# EAGLE schematic lab3 (EAGLE 9.5.2)
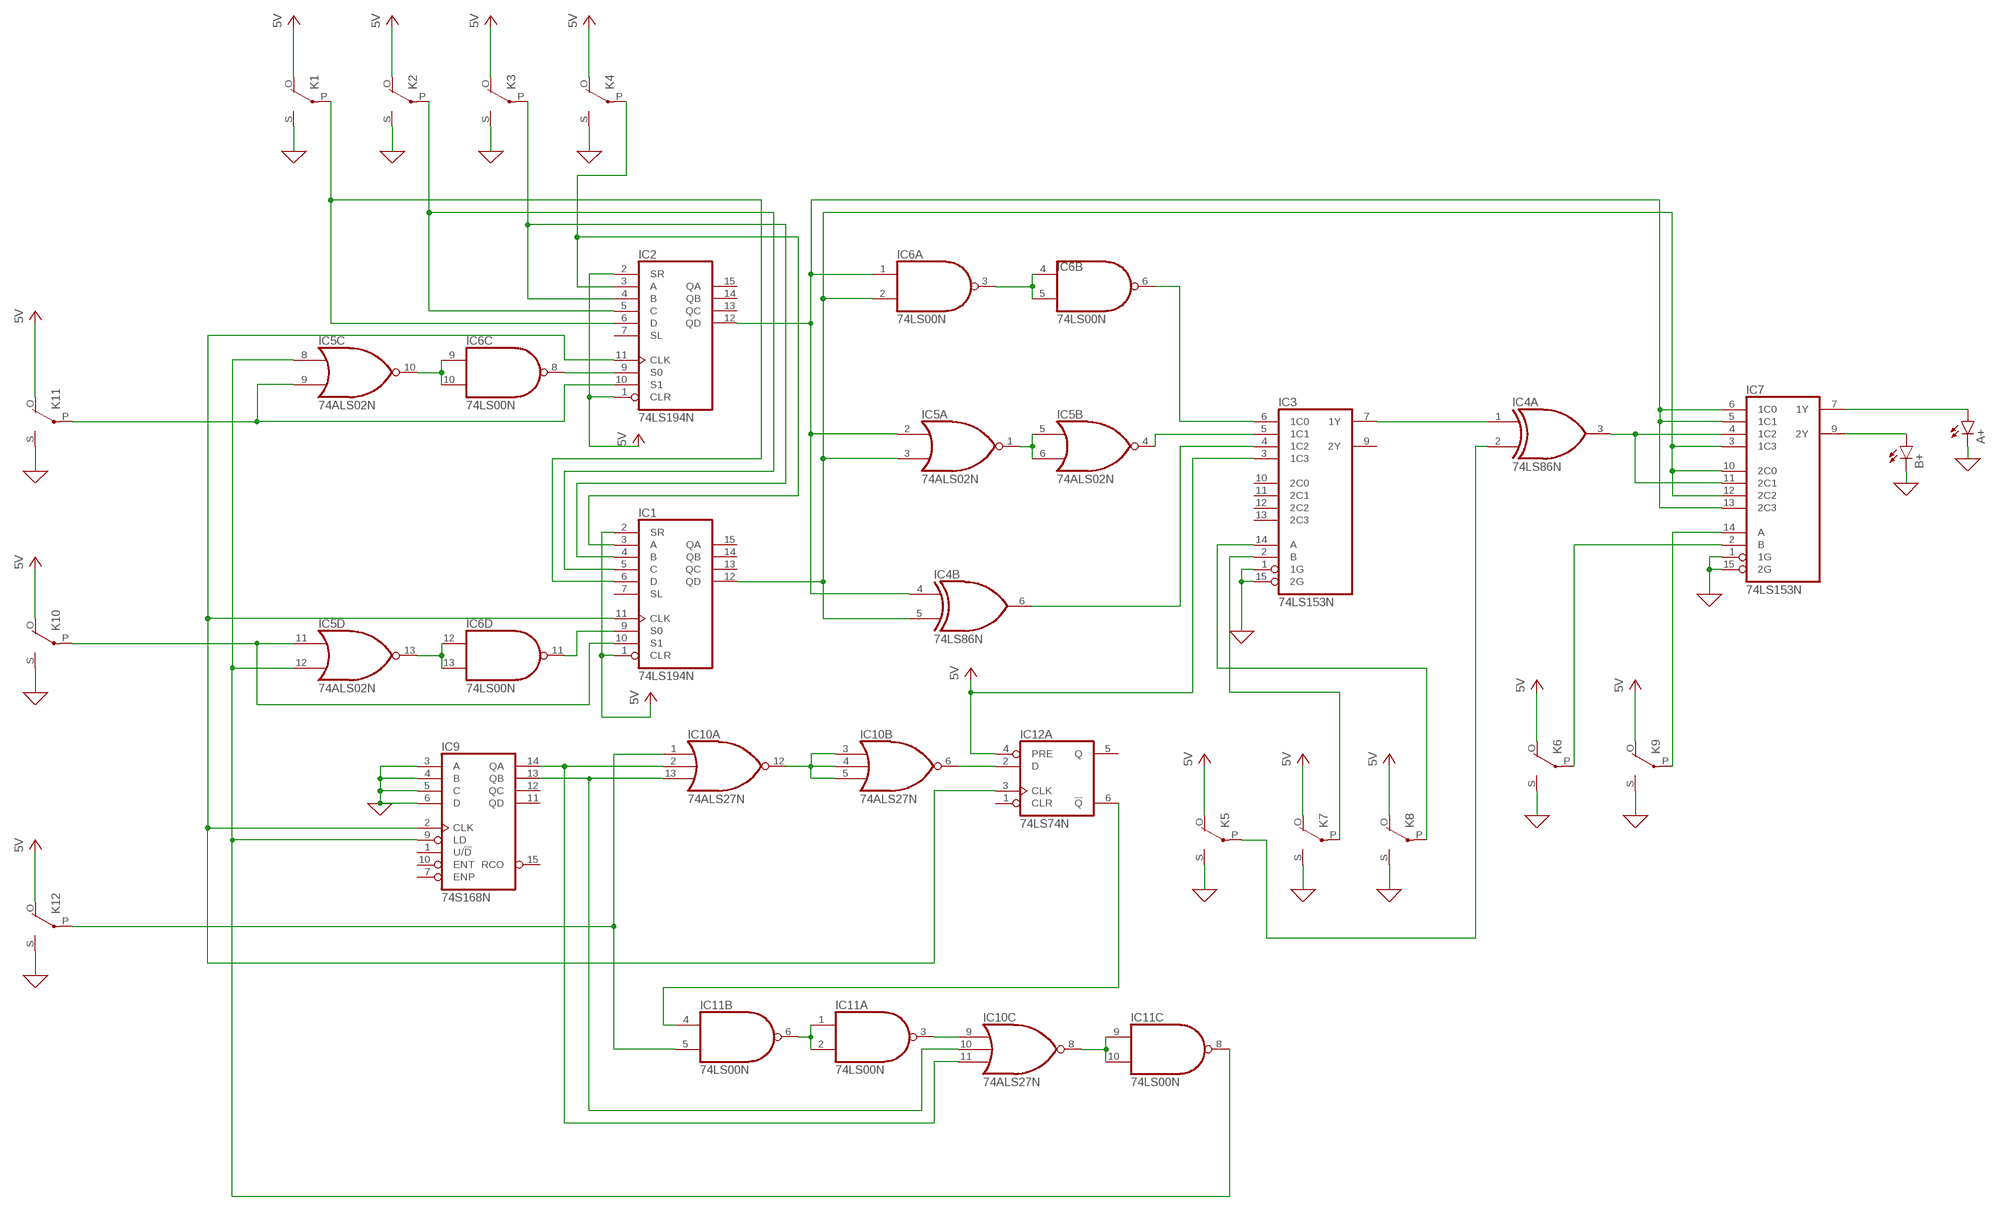
[diagram p0: schematic, sheet 1]

## Parts
A+  LED3MM  [LED3MM]
B+  LED3MM  [LED3MM]
IC1  74LS194N  [DIL16]
IC2  74LS194N  [DIL16]
IC3  74LS153N  [DIL16]
IC4  74LS86N  [DIL14]
IC5  74ALS02N  [DIL14]
IC6  74LS00N  [DIL14]
IC7  74LS153N  [DIL16]
IC9  74S168N  [DIL16]
IC10  74ALS27N  [DIL14]
IC11  74LS00N  [DIL14]
IC12  74LS74N  [DIL14]
K1  E3206L  [E3206L]
K2  E3206L  [E3206L]
K3  E3206L  [E3206L]
K4  E3206L  [E3206L]
K5  E3206L  [E3206L]
K6  E3206L  [E3206L]
K7  E3206L  [E3206L]
K8  E3206L  [E3206L]
K9  E3206L  [E3206L]
K10  E3206L  [E3206L]
K11  E3206L  [E3206L]
K12  E3206L  [E3206L]

## Nets
0: A+.K(C) B+.K(C) IC3.1(1G) IC3.15(2G) IC7.1(1G) IC7.15(2G) IC9.3(A) IC9.4(B) IC9.5(C) IC9.6(D) K1.S(2:S) K2.S(2:S) K3.S(2:S) K4.S(2:S) K5.S(2:S) K6.S(2:S) K7.S(2:S) K8.S(2:S) K9.S(2:S) K10.S(2:S) K11.S(2:S) K12.S(2:S) ; supply symbol labelled GND
N$1: IC5.10(C:O) IC6.9(C:I0) IC6.10(C:I1)
N$2: IC2.9(S0) IC6.8(C:O)
N$3: IC5.13(D:O) IC6.12(D:I0) IC6.13(D:I1)
N$4: IC1.9(S0) IC6.11(D:O)
N$5: IC5.8(C:I0) IC5.12(D:I1) IC9.9(LD) IC11.8(C:O)
N$6: IC2.10(S1) IC5.9(C:I1) K11.P(2:P)
N$7: IC1.10(S1) IC5.11(D:I0) K10.P(2:P)
N$8: IC7.14(A) K9.P(2:P)
N$9: IC7.2(B) K6.P(2:P)
N$10: IC6.3(A:O) IC6.4(B:I0) IC6.5(B:I1)
N$11: IC5.1(A:O) IC5.5(B:I0) IC5.6(B:I1)
N$12: IC3.6(1C0) IC6.6(B:O)
N$13: IC3.5(1C1) IC5.4(B:O)
N$14: IC3.4(1C2) IC4.6(B:O)
N$15: IC3.2(B) K7.P(2:P)
N$16: IC3.14(A) K8.P(2:P)
N$17: IC4.2(A:I1) K5.P(2:P)
N$18: IC4.3(A:O) IC7.4(1C2) IC7.11(2C1)
N$19: IC3.7(1Y) IC4.1(A:I0)
N$20: IC2.12(QD) IC4.4(B:I0) IC5.2(A:I0) IC6.1(A:I0) IC7.5(1C1) IC7.6(1C0) IC7.13(2C3)
N$21: IC1.12(QD) IC4.5(B:I1) IC5.3(A:I1) IC6.2(A:I1) IC7.3(1C3) IC7.10(2C0) IC7.12(2C2)
N$22: IC1.6(D) IC2.6(D) K1.P(2:P)
N$23: IC1.5(C) IC2.5(C) K2.P(2:P)
N$24: IC9.14(QA) IC10.2(A:I1) IC10.11(C:I2)
N$25: IC1.3(A) IC2.3(A) K4.P(2:P)
N$26: IC1.11(CLK) IC2.11(CLK) IC9.2(CLK) IC12.3(A:CLK)
N$27: IC9.13(QB) IC10.10(C:I1) IC10.13(A:I2)
N$28: IC1.4(B) IC2.4(B) K3.P(2:P)
N$29: IC10.3(B:I0) IC10.4(B:I1) IC10.5(B:I2) IC10.12(A:O)
N$30: IC10.6(B:O) IC12.2(A:D)
N$31: IC11.1(A:I0) IC11.2(A:I1) IC11.6(B:O)
N$32: IC10.9(C:I0) IC11.3(A:O)
N$33: IC10.8(C:O) IC11.9(C:I0) IC11.10(C:I1)
N$34: IC10.1(A:I0) IC11.5(B:I1) K12.P(2:P)
N$35: IC11.4(B:I0) IC12.6(A:!Q)
N$37: B+.A IC7.9(2Y)
N$38: A+.A IC7.7(1Y)
VCC: IC1.1(CLR) IC1.2(SR) IC2.1(CLR) IC2.2(SR) IC3.3(1C3) IC12.4(A:PRE) K1.O(2:O) K2.O(2:O) K3.O(2:O) K4.O(2:O) K5.O(2:O) K6.O(2:O) K7.O(2:O) K8.O(2:O) K9.O(2:O) K10.O(2:O) K11.O(2:O) K12.O(2:O) ; supply symbol labelled 5V
Unconnected: IC1.7(SL) IC1.13(QC) IC1.14(QB) IC1.15(QA) IC2.7(SL) IC2.13(QC) IC2.14(QB) IC2.15(QA) IC3.9(2Y) IC3.10(2C0) IC3.11(2C1) IC3.12(2C2) IC3.13(2C3) IC4.8(C:O) IC4.9(C:I0) IC4.10(C:I1) IC4.11(D:O) IC4.12(D:I0) IC4.13(D:I1) IC9.1(U/!D) IC9.7(ENP) IC9.10(ENT) IC9.11(QD) IC9.12(QC) IC9.15(RCO) IC11.11(D:O) IC11.12(D:I0) IC11.13(D:I1) IC12.1(A:CLR) IC12.5(A:Q) IC12.8(B:!Q) IC12.9(B:Q) IC12.10(B:PRE) IC12.11(B:CLK) IC12.12(B:D) IC12.13(B:CLR) K1.1 K1.2 K2.1 K2.2 K3.1 K3.2 K4.1 K4.2 K5.1 K5.2 K6.1 K6.2 K7.1 K7.2 K8.1 K8.2 K9.1 K9.2 K10.1 K10.2 K11.1 K11.2 K12.1 K12.2

## Power pins joined to a net without a drawn wire
GND: IC1.8(GND) IC2.8(GND) IC3.8(GND) IC4.7(P:GND) IC5.7(P:GND) IC6.7(P:GND) IC7.8(GND) IC9.8(GND) IC10.7(P:GND) IC11.7(P:GND) IC12.7(P:GND)
VCC: IC1.16(VCC) IC2.16(VCC) IC3.16(VCC) IC4.14(P:VCC) IC5.14(P:VCC) IC6.14(P:VCC) IC7.16(VCC) IC9.16(VCC) IC10.14(P:VCC) IC11.14(P:VCC) IC12.14(P:VCC)

## Library data of the parts
A+ B+ = led:LED: LED OSRAM: - CHIPLED LG R971, LG N971, LY N971, LG Q971, LY Q971, LO R971, LY R971 LH N974, LH R974 LS Q976, LO Q976, LY Q976 LO Q996 - Hyper CHIPLED LW Q18S LB Q993, LB Q99A, LB R99A - SideLED LS A670, LO A670, LY A670, LG A670, LP A670 LB A673, LV A673, LT A673, LW A673 LH A674 LY A675 LS A676, LA A676, LO A676, LY A676, LW A676 LS A679, LY A679, LG A679 - Hyper Micro SIDELED® LS Y876, LA Y876, LO Y876, LY Y876 LT Y87S - SmartLED LW L88C, LW L88S LB L89C, LB L89S, LG L890 LS L89K, LO L89K, LY L89K LS L896, LA L896, LO L896, LY L896 - TOPLED LS T670, LO T670, LY T670, LG T670, LP T670 LSG T670, LSP T670, LSY T670, LOP T670, LYG T670 LG T671, LOG T671, LSG T671 LB T673, LV T673, LT T673, LW T673 LH T674 LS T676, LA T676, LO T676, LY T676, LB T676, LH T676, LSB T676, LW T676 LB T67C, LV T67C, LT T67C, LS T67K, LO T67K, LY T67K, LW E67C LS E67B, LA E67B, LO E67B, LY E67B, LB E67C, LV E67C, LT E67C LW T67C LS T679, LY T679, LG T679 LS T770, LO T770, LY T770, LG T770, LP T770 LB T773, LV T773, LT T773, LW T773 LH T774 LS E675, LA E675, LY E675, LS T675 LS T776, LA T776, LO T776, LY T776, LB T776 LHGB T686 LT T68C, LB T68C - Hyper Mini TOPLED® LB M676 - Mini TOPLED Santana® LG M470 LS M47K, LO M47K, LY M47K Source: http://www.osram.convergy.de LUXEON: - LUMILED® LXK2-PW12-R00, LXK2-PW12-S00, LXK2-PW14-U00, LXK2-PW14-V00 LXK2-PM12-R00, LXK2-PM12-S00, LXK2-PM14-U00 LXK2-PE12-Q00, LXK2-PE12-R00, LXK2-PE12-S00, LXK2-PE14-T00, LXK2-PE14-U00 LXK2-PB12-K00, LXK2-PB12-L00, LXK2-PB12-M00, LXK2-PB14-N00, LXK2-PB14-P00, LXK2-PB14-Q00 LXK2-PR12-L00, LXK2-PR12-M00, LXK2-PR14-Q00, LXK2-PR14-R00 LXK2-PD12-Q00, LXK2-PD12-R00, LXK2-PD12-S00 LXK2-PH12-R00, LXK2-PH12-S00 LXK2-PL12-P00, LXK2-PL12-Q00, LXK2-PL12-R00 Source: www.luxeon.com KINGBRIGHT: KA-3528ASYC Source: www.kingbright.com
IC1 IC2 = 74xx-us:74*194: 4-bit bidirectional SHIFT REGISTER
IC3 IC7 = 74xx-us:74*153: Dual 4-line to 1-line data SELECTOR/MULTIPLEXER
IC4 = 74xx-us:74*86: Quad 2-input EXCLUSIV-OR (XOR) gate
IC5 = 74xx-us:74*02: Quad 2-input NOR gate
IC6 IC11 = 74xx-us:74*00: Quad 2-input NAND gate
IC9 = 74xx-us:74*168: Synchronous 4-bit UP/DOWN COUNTER
IC10 = 74xx-us:74*27: Triple 3-input NOR gate
IC12 = 74xx-us:74*74: Dual D type positive edge triggered FLIP FLOP, preset and clear
K1-K12 = relay:E3206L: RELAY 1 x switch, Eichhoff/distributor Schukat; OC_FARNELL: unknown; OC_NEWARK: unknown